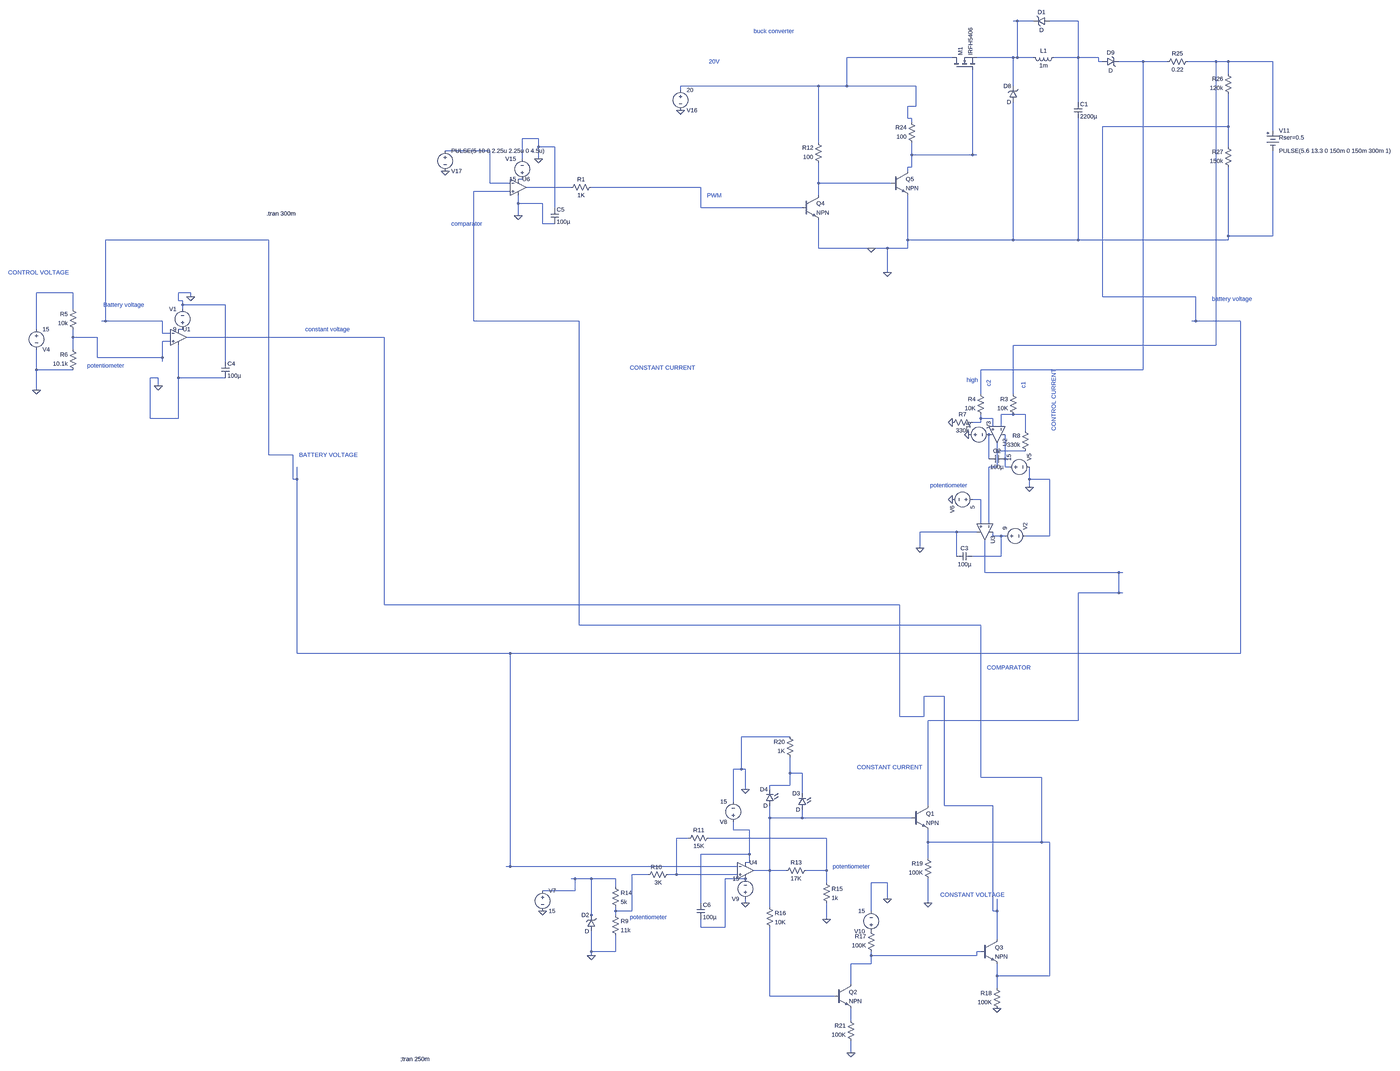
[diagram p0: schematic final_simulation_x.asc, whole sheet]
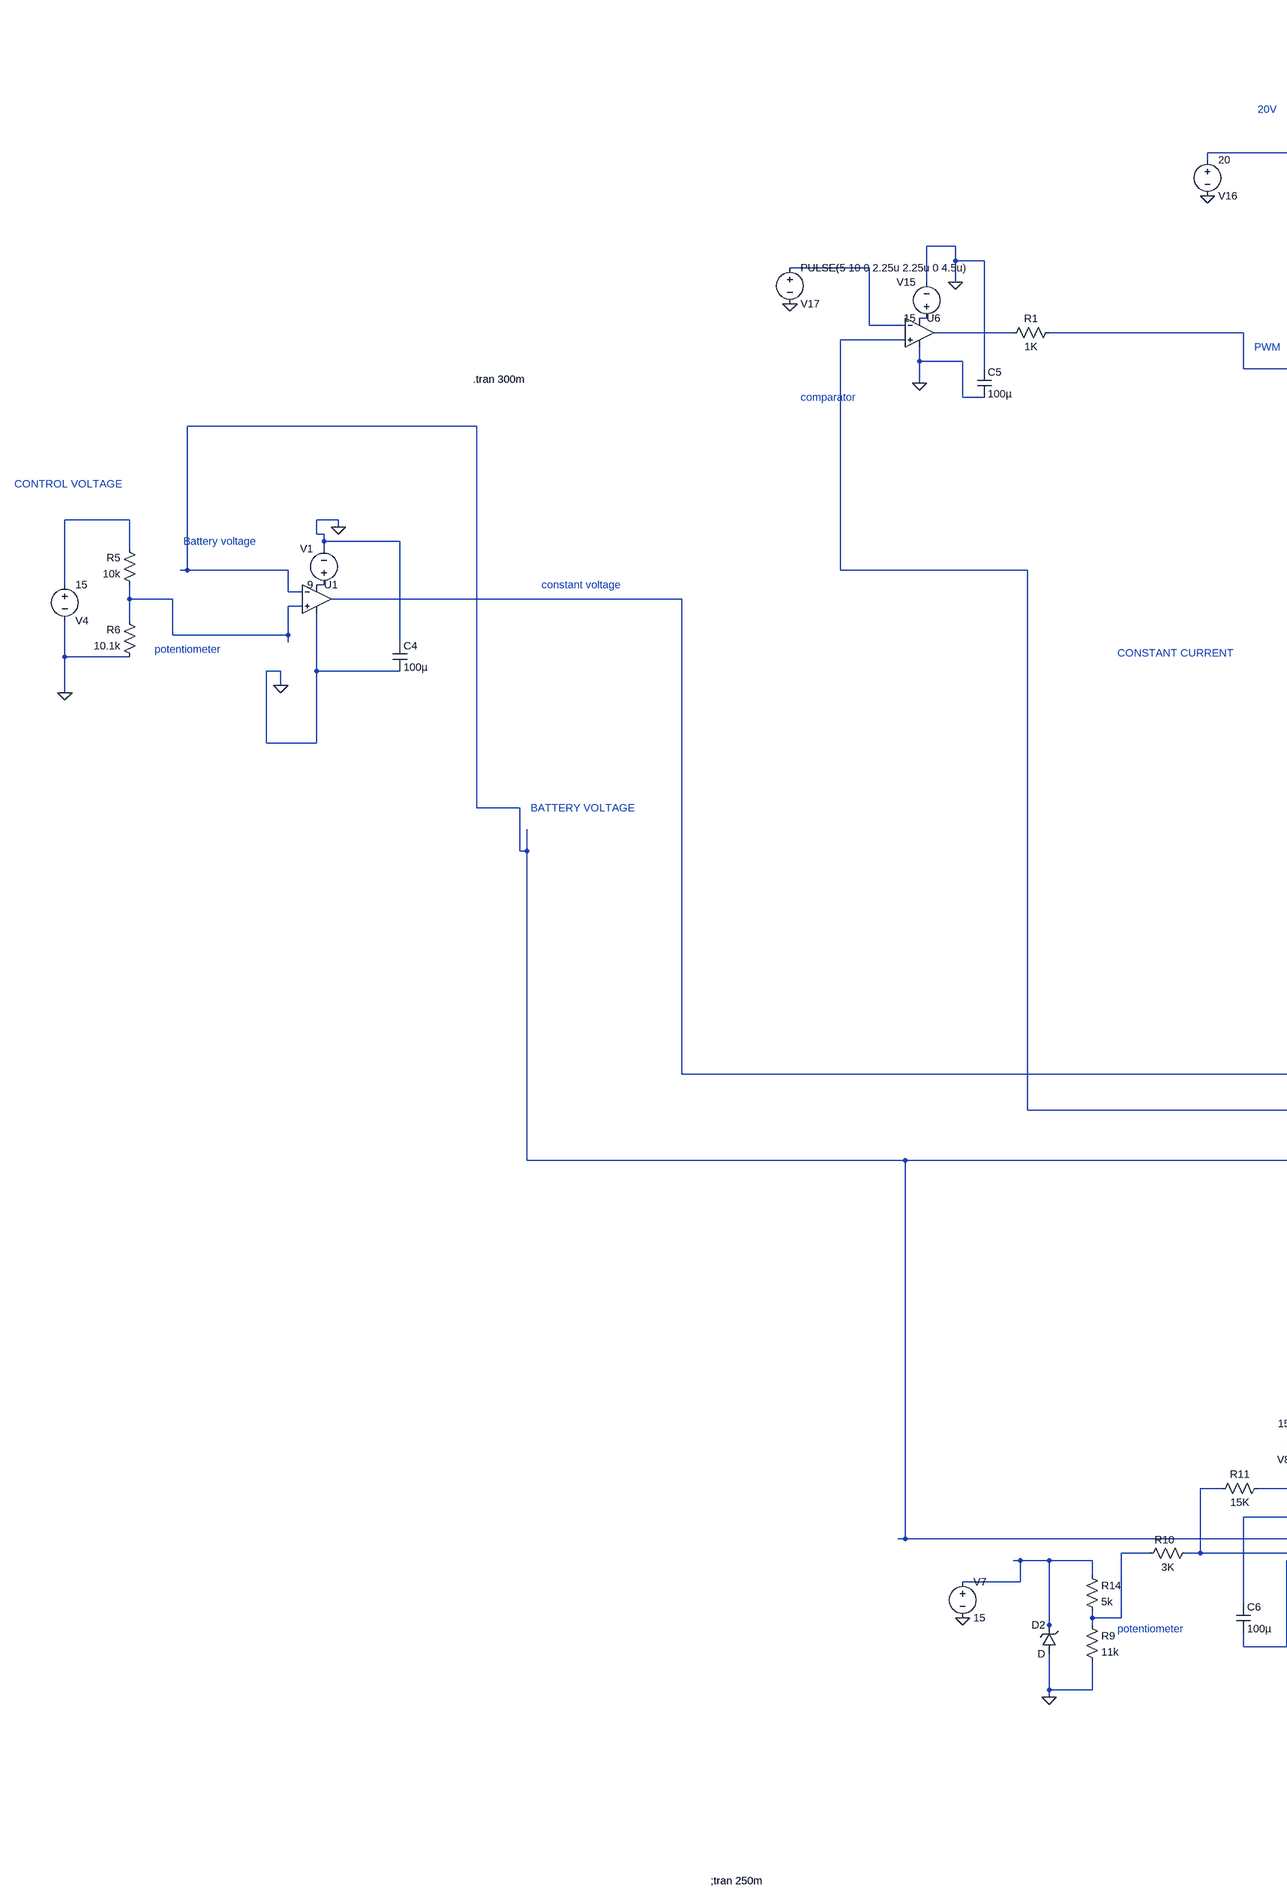
[diagram p1: schematic final_simulation_x.asc, part, row 1 of 1, column 1 of 2]
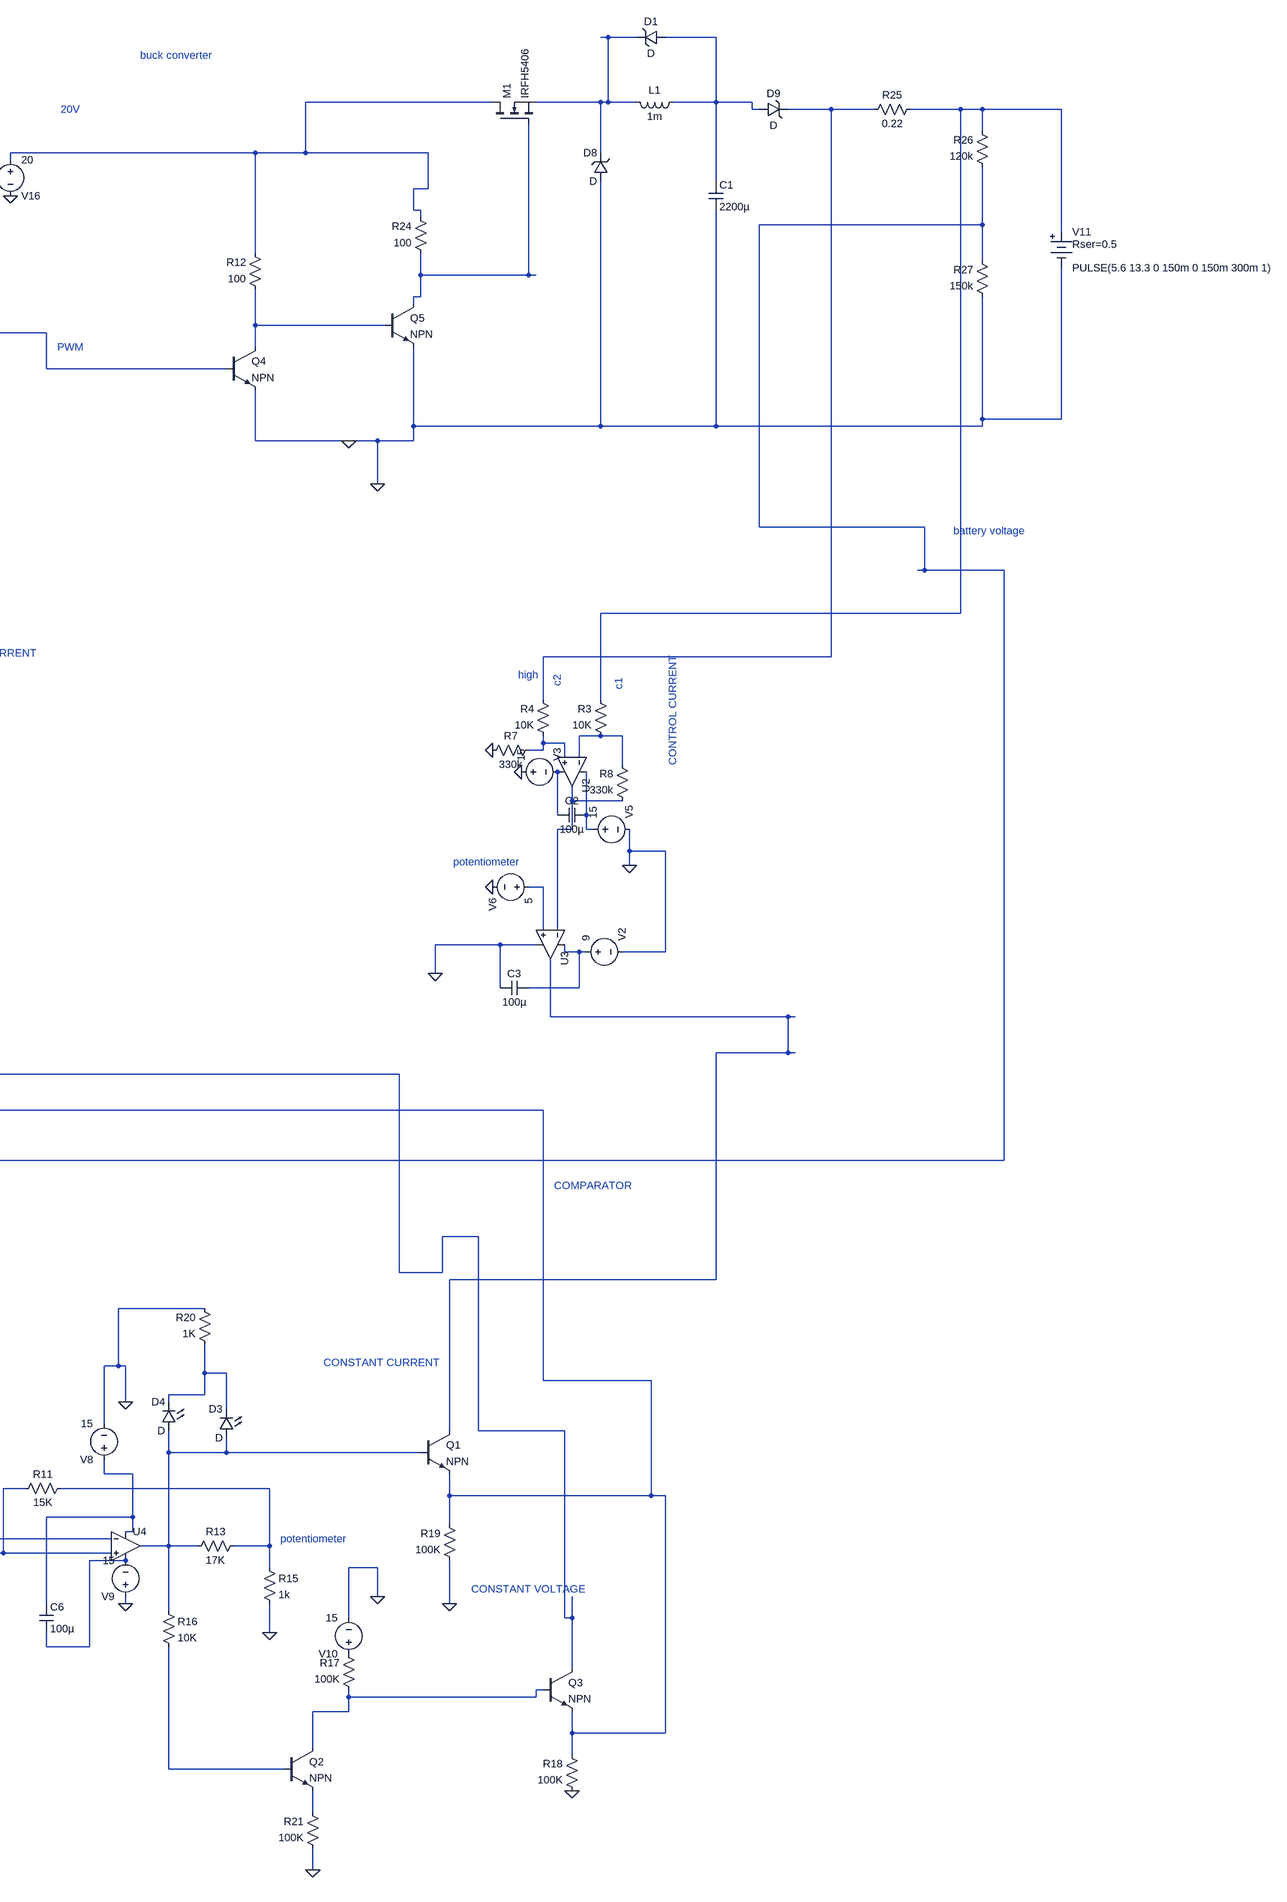
[diagram p2: schematic final_simulation_x.asc, part, row 1 of 1, column 2 of 2]
final_simulation_x.asc, the LTspice schematic file:
Version 4
SHEET 1 880 680
WIRE -407760 -284800 -407776 -284800
WIRE -407696 -284800 -407760 -284800
WIRE -407520 -284800 -407632 -284800
WIRE -408016 -284656 -408432 -284656
WIRE -407776 -284656 -407920 -284656
WIRE -407760 -284656 -407760 -284800
WIRE -407760 -284656 -407776 -284656
WIRE -407696 -284656 -407760 -284656
WIRE -407520 -284656 -407520 -284800
WIRE -407520 -284656 -407616 -284656
WIRE -407440 -284656 -407520 -284656
WIRE -407440 -284640 -407440 -284656
WIRE -407424 -284640 -407440 -284640
WIRE -407264 -284640 -407360 -284640
WIRE -407168 -284640 -407264 -284640
WIRE -406976 -284640 -407088 -284640
WIRE -406928 -284640 -406976 -284640
WIRE -406752 -284640 -406928 -284640
WIRE -406928 -284592 -406928 -284640
WIRE -408544 -284544 -409088 -284544
WIRE -408432 -284544 -408432 -284656
WIRE -408432 -284544 -408544 -284544
WIRE -408160 -284544 -408432 -284544
WIRE -407776 -284544 -407776 -284656
WIRE -409088 -284528 -409088 -284544
WIRE -407520 -284480 -407520 -284656
WIRE -408160 -284464 -408160 -284544
WIRE -408160 -284464 -408192 -284464
WIRE -408192 -284416 -408192 -284464
WIRE -408176 -284416 -408192 -284416
WIRE -408176 -284400 -408176 -284416
WIRE -406928 -284384 -406928 -284512
WIRE -406928 -284384 -407424 -284384
WIRE -406752 -284368 -406752 -284640
WIRE -409648 -284336 -409712 -284336
WIRE -408544 -284320 -408544 -284544
WIRE -409648 -284304 -409648 -284336
WIRE -409584 -284304 -409648 -284304
WIRE -406928 -284304 -406928 -284384
WIRE -409840 -284288 -410016 -284288
WIRE -408176 -284272 -408176 -284320
WIRE -407936 -284272 -407936 -284608
WIRE -407936 -284272 -408176 -284272
WIRE -407920 -284272 -407936 -284272
WIRE -409712 -284256 -409712 -284336
WIRE -409648 -284256 -409648 -284304
WIRE -408176 -284224 -408176 -284272
WIRE -408176 -284224 -408192 -284224
WIRE -408192 -284208 -408192 -284224
WIRE -409712 -284176 -409728 -284176
WIRE -409840 -284160 -409840 -284288
WIRE -409760 -284160 -409840 -284160
WIRE -408544 -284160 -408544 -284240
WIRE -408256 -284160 -408544 -284160
WIRE -409520 -284144 -409696 -284144
WIRE -409008 -284144 -409440 -284144
WIRE -409760 -284128 -409904 -284128
WIRE -408544 -284112 -408544 -284160
WIRE -409728 -284080 -409728 -284112
WIRE -409632 -284080 -409728 -284080
WIRE -409584 -284064 -409584 -284304
WIRE -409008 -284064 -409008 -284144
WIRE -408608 -284064 -409008 -284064
WIRE -409728 -284032 -409728 -284080
WIRE -409632 -284000 -409632 -284080
WIRE -409584 -284000 -409632 -284000
WIRE -406928 -283952 -406928 -284224
WIRE -406752 -283952 -406752 -284288
WIRE -406752 -283952 -406928 -283952
WIRE -410784 -283936 -411584 -283936
WIRE -408192 -283936 -408192 -284112
WIRE -407776 -283936 -407776 -284480
WIRE -407776 -283936 -408192 -283936
WIRE -407520 -283936 -407520 -284416
WIRE -407520 -283936 -407776 -283936
WIRE -406928 -283936 -406928 -283952
WIRE -406928 -283936 -407520 -283936
WIRE -408544 -283904 -408544 -284016
WIRE -408336 -283904 -408544 -283904
WIRE -408272 -283904 -408336 -283904
WIRE -408192 -283904 -408192 -283936
WIRE -408192 -283904 -408272 -283904
WIRE -408272 -283808 -408272 -283904
WIRE -411712 -283728 -411856 -283728
WIRE -411248 -283728 -411296 -283728
WIRE -411248 -283712 -411248 -283728
WIRE -407424 -283712 -407424 -284384
WIRE -407056 -283712 -407424 -283712
WIRE -411296 -283696 -411296 -283728
WIRE -411280 -283696 -411296 -283696
WIRE -411280 -283680 -411280 -283696
WIRE -411056 -283680 -411280 -283680
WIRE -411712 -283664 -411712 -283728
WIRE -411280 -283664 -411280 -283680
WIRE -411584 -283616 -411584 -283936
WIRE -411584 -283616 -411600 -283616
WIRE -411360 -283616 -411584 -283616
WIRE -409904 -283616 -409904 -284128
WIRE -409488 -283616 -409904 -283616
WIRE -407056 -283616 -407056 -283712
WIRE -407056 -283616 -407072 -283616
WIRE -406880 -283616 -407056 -283616
WIRE -411856 -283584 -411856 -283728
WIRE -411280 -283584 -411296 -283584
WIRE -411360 -283568 -411360 -283616
WIRE -411328 -283568 -411360 -283568
WIRE -411712 -283552 -411712 -283584
WIRE -411616 -283552 -411712 -283552
WIRE -410256 -283552 -411264 -283552
WIRE -411328 -283536 -411360 -283536
WIRE -406976 -283520 -406976 -284640
WIRE -406976 -283520 -407776 -283520
WIRE -411712 -283504 -411712 -283552
WIRE -411616 -283472 -411616 -283552
WIRE -411360 -283472 -411360 -283536
WIRE -411360 -283472 -411616 -283472
WIRE -411360 -283456 -411360 -283472
WIRE -411056 -283456 -411056 -283680
WIRE -411856 -283424 -411856 -283504
WIRE -411712 -283424 -411856 -283424
WIRE -407264 -283424 -407264 -284640
WIRE -407264 -283424 -407904 -283424
WIRE -411376 -283392 -411408 -283392
WIRE -411296 -283392 -411296 -283520
WIRE -411056 -283392 -411296 -283392
WIRE -411376 -283360 -411376 -283392
WIRE -411856 -283344 -411856 -283424
WIRE -407904 -283328 -407904 -283424
WIRE -407776 -283328 -407776 -283520
WIRE -407776 -283248 -407824 -283248
WIRE -407728 -283248 -407776 -283248
WIRE -411408 -283232 -411408 -283392
WIRE -411296 -283232 -411296 -283392
WIRE -411296 -283232 -411408 -283232
WIRE -407904 -283232 -407904 -283248
WIRE -407856 -283232 -407904 -283232
WIRE -407904 -283216 -407904 -283232
WIRE -407904 -283216 -407936 -283216
WIRE -407856 -283200 -407856 -283232
WIRE -407824 -283200 -407824 -283248
WIRE -407728 -283184 -407728 -283248
WIRE -407840 -283104 -407840 -283136
WIRE -407728 -283104 -407840 -283104
WIRE -410784 -283088 -410784 -283936
WIRE -410688 -283088 -410784 -283088
WIRE -407872 -283072 -407872 -283168
WIRE -407808 -283072 -407808 -283168
WIRE -407840 -283040 -407840 -283104
WIRE -407840 -283040 -407872 -283040
WIRE -407808 -283040 -407808 -283072
WIRE -407792 -283040 -407808 -283040
WIRE -410688 -282992 -410688 -283088
WIRE -410672 -282992 -410672 -283040
WIRE -410672 -282992 -410688 -282992
WIRE -407712 -282992 -407712 -283040
WIRE -407632 -282992 -407712 -282992
WIRE -407712 -282960 -407712 -282992
WIRE -407904 -282912 -407936 -282912
WIRE -407904 -282816 -407904 -282912
WIRE -407872 -282816 -407872 -283040
WIRE -408000 -282784 -408144 -282784
WIRE -407920 -282784 -408000 -282784
WIRE -407856 -282768 -407856 -282784
WIRE -407824 -282768 -407856 -282768
WIRE -407808 -282768 -407824 -282768
WIRE -407632 -282768 -407632 -282992
WIRE -407632 -282768 -407728 -282768
WIRE -408144 -282720 -408144 -282784
WIRE -408000 -282688 -408000 -282784
WIRE -407824 -282688 -407824 -282768
WIRE -407824 -282688 -407936 -282688
WIRE -407888 -282624 -407888 -282752
WIRE -407360 -282624 -407888 -282624
WIRE -407344 -282624 -407360 -282624
WIRE -407360 -282544 -407360 -282624
WIRE -407360 -282544 -407520 -282544
WIRE -407344 -282544 -407360 -282544
WIRE -410256 -282496 -410256 -283552
WIRE -408224 -282496 -410256 -282496
WIRE -409488 -282416 -409488 -283616
WIRE -407904 -282416 -409488 -282416
WIRE -410672 -282128 -410672 -282992
WIRE -409760 -282128 -410672 -282128
WIRE -406880 -282128 -406880 -283616
WIRE -406880 -282128 -409760 -282128
WIRE -408048 -281904 -408128 -281904
WIRE -408224 -281824 -408224 -282496
WIRE -408128 -281824 -408128 -281904
WIRE -408128 -281824 -408224 -281824
WIRE -407520 -281808 -407520 -282544
WIRE -407520 -281808 -408112 -281808
WIRE -408656 -281744 -408848 -281744
WIRE -408848 -281616 -408848 -281744
WIRE -408848 -281616 -408880 -281616
WIRE -408832 -281616 -408848 -281616
WIRE -408656 -281600 -408656 -281664
WIRE -408608 -281600 -408656 -281600
WIRE -407904 -281584 -407904 -282416
WIRE -407664 -281584 -407904 -281584
WIRE -408656 -281552 -408656 -281600
WIRE -408656 -281552 -408736 -281552
WIRE -408832 -281536 -408832 -281616
WIRE -408736 -281536 -408736 -281552
WIRE -408608 -281520 -408608 -281600
WIRE -408880 -281488 -408880 -281616
WIRE -408112 -281472 -408112 -281808
WIRE -408048 -281472 -408048 -281904
WIRE -407856 -281472 -408048 -281472
WIRE -408736 -281424 -408736 -281472
WIRE -408608 -281424 -408608 -281456
WIRE -408608 -281424 -408736 -281424
WIRE -408176 -281424 -408608 -281424
WIRE -408880 -281376 -408880 -281408
WIRE -408816 -281376 -408880 -281376
WIRE -409056 -281344 -409104 -281344
WIRE -408512 -281344 -408976 -281344
WIRE -408112 -281328 -408112 -281376
WIRE -407664 -281328 -407664 -281584
WIRE -407664 -281328 -408112 -281328
WIRE -407632 -281328 -407664 -281328
WIRE -408816 -281280 -408816 -281376
WIRE -408816 -281280 -409008 -281280
WIRE -408112 -281264 -408112 -281328
WIRE -408816 -281248 -408816 -281280
WIRE -408816 -281248 -408832 -281248
WIRE -409760 -281232 -409760 -282128
WIRE -409760 -281232 -409776 -281232
WIRE -408864 -281232 -409760 -281232
WIRE -408736 -281216 -408736 -281424
WIRE -408736 -281216 -408800 -281216
WIRE -408672 -281216 -408736 -281216
WIRE -408512 -281216 -408512 -281344
WIRE -408512 -281216 -408592 -281216
WIRE -409216 -281200 -409280 -281200
WIRE -409104 -281200 -409104 -281344
WIRE -409104 -281200 -409136 -281200
WIRE -408864 -281200 -409104 -281200
WIRE -409504 -281184 -409520 -281184
WIRE -409440 -281184 -409504 -281184
WIRE -409344 -281184 -409440 -281184
WIRE -408832 -281184 -408912 -281184
WIRE -408512 -281168 -408512 -281216
WIRE -408272 -281168 -408336 -281168
WIRE -409344 -281152 -409344 -281184
WIRE -409504 -281136 -409504 -281184
WIRE -409504 -281136 -409632 -281136
WIRE -408272 -281104 -408272 -281168
WIRE -409008 -281088 -409008 -281280
WIRE -408832 -281088 -408832 -281104
WIRE -408112 -281088 -408112 -281184
WIRE -408736 -281072 -408736 -281216
WIRE -409344 -281056 -409344 -281072
WIRE -409280 -281056 -409280 -281200
WIRE -409280 -281056 -409344 -281056
WIRE -408336 -281056 -408336 -281168
WIRE -407856 -281056 -407856 -281472
WIRE -407840 -281056 -407840 -281104
WIRE -407840 -281056 -407856 -281056
WIRE -409440 -281040 -409440 -281184
WIRE -409344 -281040 -409344 -281056
WIRE -409440 -281024 -409440 -281040
WIRE -408512 -281024 -408512 -281088
WIRE -409008 -280992 -409008 -281024
WIRE -408912 -280992 -408912 -281184
WIRE -408912 -280992 -409008 -280992
WIRE -407840 -280944 -407840 -281056
WIRE -409440 -280896 -409440 -280976
WIRE -409344 -280896 -409344 -280960
WIRE -409344 -280896 -409440 -280896
WIRE -407904 -280896 -407920 -280896
WIRE -409440 -280880 -409440 -280896
WIRE -408336 -280880 -408336 -280896
WIRE -407920 -280880 -407920 -280896
WIRE -407920 -280880 -408336 -280880
WIRE -408336 -280848 -408336 -280880
WIRE -408336 -280848 -408416 -280848
WIRE -407840 -280800 -407840 -280848
WIRE -407632 -280800 -407632 -281328
WIRE -407632 -280800 -407840 -280800
WIRE -408416 -280768 -408416 -280848
WIRE -407840 -280752 -407840 -280800
WIRE -408736 -280720 -408736 -280992
WIRE -408480 -280720 -408736 -280720
WIRE -408416 -280624 -408416 -280672
WIRE -408416 -280496 -408416 -280544
FLAG -411248 -283712 0
FLAG -411376 -283360 0
FLAG -411856 -283344 0
FLAG -408016 -283216 0
FLAG -407712 -282960 0
FLAG -407952 -283168 0
FLAG -408016 -282912 0
FLAG -408336 -283904 0
FLAG -408272 -283808 0
FLAG -409648 -284256 0
FLAG -409728 -284032 0
FLAG -410016 -284208 0
FLAG -409088 -284448 0
FLAG -409440 -280880 0
FLAG -408512 -281024 0
FLAG -409632 -281056 0
FLAG -408832 -281536 0
FLAG -408832 -281088 0
FLAG -408272 -281104 0
FLAG -407840 -280672 0
FLAG -408112 -281088 0
FLAG -408416 -280496 0
FLAG -408144 -282720 0
DATAFLAG -408016 -281472 ""
DATAFLAG -409680 -284144 ""
DATAFLAG -407456 -283936 ""
SYMBOL voltage -411280 -283568 R180
WINDOW 0 24 96 Left 2
WINDOW 3 24 16 Left 2
WINDOW 123 0 0 Left 0
WINDOW 39 0 0 Left 0
SYMATTR InstName V1
SYMATTR Value 9
SYMBOL res -411696 -283568 R180
WINDOW 0 36 76 Left 2
WINDOW 3 36 40 Left 2
SYMATTR InstName R5
SYMATTR Value 10k
SYMBOL res -411696 -283408 R180
WINDOW 0 36 76 Left 2
WINDOW 3 36 40 Left 2
SYMATTR InstName R6
SYMATTR Value 10.1k
SYMBOL voltage -411856 -283600 R0
WINDOW 0 24 96 Left 2
WINDOW 3 24 16 Left 2
WINDOW 123 0 0 Left 0
WINDOW 39 0 0 Left 0
SYMATTR InstName V4
SYMATTR Value 15
SYMBOL res -407760 -283232 R180
WINDOW 0 36 76 Left 2
WINDOW 3 36 40 Left 2
SYMATTR InstName R3
SYMATTR Value 10K
SYMBOL res -407888 -283232 R180
WINDOW 0 36 76 Left 2
WINDOW 3 36 40 Left 2
SYMATTR InstName R4
SYMATTR Value 10K
SYMBOL res -408032 -283200 R270
WINDOW 0 32 56 VTop 2
WINDOW 3 0 56 VBottom 2
SYMATTR InstName R7
SYMATTR Value 330k
SYMBOL res -407712 -283088 R180
WINDOW 0 36 76 Left 2
WINDOW 3 36 40 Left 2
SYMATTR InstName R8
SYMATTR Value 330k
SYMBOL voltage -407968 -283168 R270
WINDOW 0 24 96 Left 2
WINDOW 3 24 16 Left 2
WINDOW 123 0 0 Left 0
WINDOW 39 0 0 Left 0
SYMATTR InstName V3
SYMATTR Value 15
SYMBOL voltage -407808 -283040 R270
WINDOW 0 24 96 Left 2
WINDOW 3 24 16 Left 2
WINDOW 123 0 0 Left 0
WINDOW 39 0 0 Left 0
SYMATTR InstName V5
SYMATTR Value 15
SYMBOL voltage -407920 -282912 R90
WINDOW 0 24 96 Left 2
WINDOW 3 24 16 Left 2
WINDOW 123 0 0 Left 0
WINDOW 39 0 0 Left 0
SYMATTR InstName V6
SYMATTR Value 5
SYMBOL res -408528 -284224 R180
WINDOW 0 36 76 Left 2
WINDOW 3 36 40 Left 2
SYMATTR InstName R12
SYMATTR Value 100
SYMBOL res -408160 -284304 R180
WINDOW 0 36 76 Left 2
WINDOW 3 36 40 Left 2
SYMATTR InstName R24
SYMATTR Value 100
SYMBOL npn -408608 -284112 R0
SYMATTR InstName Q4
SYMBOL npn -408256 -284208 R0
SYMATTR InstName Q5
SYMBOL nmos -408016 -284608 R270
SYMATTR InstName M1
SYMATTR Value IRFH5406
SYMBOL zener -407760 -284480 R180
WINDOW 0 24 64 Left 2
WINDOW 3 24 0 Left 2
SYMATTR InstName D8
SYMBOL ind -407600 -284672 R90
WINDOW 0 5 56 VBottom 2
WINDOW 3 32 56 VTop 2
SYMATTR InstName L1
SYMATTR Value 1m
SYMBOL cap -407536 -284480 R0
SYMATTR InstName C1
SYMATTR Value 2200µ
SYMATTR SpiceLine2 ic=0
SYMBOL zener -407424 -284624 R270
WINDOW 0 36 32 VTop 2
WINDOW 3 -4 32 VBottom 2
SYMATTR InstName D9
SYMBOL res -407072 -284656 R90
WINDOW 0 0 56 VBottom 2
WINDOW 3 32 56 VTop 2
SYMATTR InstName R25
SYMATTR Value 0.22
SYMBOL res -406912 -284496 R180
WINDOW 0 36 76 Left 2
WINDOW 3 36 40 Left 2
SYMATTR InstName R26
SYMATTR Value 120k
SYMBOL res -406912 -284208 R180
WINDOW 0 36 76 Left 2
WINDOW 3 36 40 Left 2
SYMATTR InstName R27
SYMATTR Value 150k
SYMBOL Misc\\battery -406752 -284384 R0
WINDOW 123 0 0 Left 0
WINDOW 39 24 44 Left 2
SYMATTR SpiceLine Rser=0.5
SYMATTR InstName V11
SYMATTR Value PULSE(5.6 13.3 0 150m 0 150m 300m 1)
SYMBOL voltage -409712 -284160 R180
WINDOW 0 24 96 Left 2
WINDOW 3 24 16 Left 2
WINDOW 123 0 0 Left 0
WINDOW 39 0 0 Left 0
SYMATTR InstName V15
SYMATTR Value 15
SYMBOL voltage -409088 -284544 R0
WINDOW 0 24 96 Left 2
WINDOW 3 24 16 Left 2
WINDOW 123 0 0 Left 0
WINDOW 39 0 0 Left 0
SYMATTR InstName V16
SYMATTR Value 20
SYMBOL voltage -410016 -284304 R0
WINDOW 0 24 96 Left 2
WINDOW 3 24 16 Left 2
WINDOW 123 0 0 Left 0
WINDOW 39 0 0 Left 0
SYMATTR InstName V17
SYMATTR Value PULSE(5 10 0 2.25u 2.25u 0 4.5u)
SYMBOL OpAmps\\UniversalOpAmp2 -411296 -283552 R0
SYMATTR InstName U1
SYMBOL OpAmps\\UniversalOpAmp2 -409728 -284144 R0
SYMATTR InstName U6
SYMBOL OpAmps\\UniversalOpAmp2 -407840 -283168 R90
SYMATTR InstName U2
SYMBOL OpAmps\\UniversalOpAmp2 -407888 -282784 R90
SYMATTR InstName U3
SYMBOL zener -407632 -284816 R90
WINDOW 0 -4 32 VBottom 2
WINDOW 3 36 32 VTop 2
SYMATTR InstName D1
SYMBOL zener -409424 -280976 R180
WINDOW 0 24 64 Left 2
WINDOW 3 24 0 Left 2
SYMATTR InstName D2
SYMBOL res -409360 -281056 R0
SYMATTR InstName R9
SYMATTR Value 11k
SYMBOL res -409120 -281216 R90
WINDOW 0 2 63 VBottom 2
WINDOW 3 32 56 VTop 2
SYMATTR InstName R10
SYMATTR Value 3K
SYMBOL res -408960 -281360 R90
WINDOW 0 0 56 VBottom 2
WINDOW 3 32 56 VTop 2
SYMATTR InstName R11
SYMATTR Value 15K
SYMBOL LED -408592 -281456 R180
WINDOW 0 24 64 Left 2
WINDOW 3 24 0 Left 2
SYMATTR InstName D3
SYMBOL res -408576 -281232 R90
WINDOW 0 0 56 VBottom 2
WINDOW 3 32 56 VTop 2
SYMATTR InstName R13
SYMATTR Value 17K
SYMBOL res -409360 -281168 R0
SYMATTR InstName R14
SYMATTR Value 5k
SYMBOL LED -408720 -281472 R180
WINDOW 0 24 64 Left 2
WINDOW 3 24 0 Left 2
SYMATTR InstName D4
SYMBOL res -408528 -281184 R0
SYMATTR InstName R15
SYMATTR Value 1k
SYMBOL res -408752 -281088 R0
SYMATTR InstName R16
SYMATTR Value 10K
SYMBOL voltage -409632 -281152 R0
WINDOW 123 0 0 Left 0
WINDOW 39 0 0 Left 0
SYMATTR InstName V7
SYMATTR Value 15
SYMBOL voltage -408880 -281392 R180
WINDOW 123 0 0 Left 0
WINDOW 39 0 0 Left 0
SYMATTR InstName V8
SYMATTR Value 15
SYMBOL voltage -408832 -281088 R180
WINDOW 123 0 0 Left 0
WINDOW 39 0 0 Left 0
SYMATTR InstName V9
SYMATTR Value 15
SYMBOL npn -408176 -281472 R0
SYMATTR InstName Q1
SYMBOL npn -408480 -280768 R0
SYMATTR InstName Q2
SYMBOL npn -407904 -280944 R0
SYMATTR InstName Q3
SYMBOL res -408320 -280880 R180
WINDOW 0 36 76 Left 2
WINDOW 3 36 40 Left 2
SYMATTR InstName R17
SYMATTR Value 100K
SYMBOL res -407824 -280656 R180
WINDOW 0 36 76 Left 2
WINDOW 3 36 40 Left 2
SYMATTR InstName R18
SYMATTR Value 100K
SYMBOL res -408096 -281168 R180
WINDOW 0 36 76 Left 2
WINDOW 3 36 40 Left 2
SYMATTR InstName R19
SYMATTR Value 100K
SYMBOL res -408640 -281648 R180
WINDOW 0 36 76 Left 2
WINDOW 3 36 40 Left 2
SYMATTR InstName R20
SYMATTR Value 1K
SYMBOL voltage -408336 -280960 R180
WINDOW 123 0 0 Left 0
WINDOW 39 0 0 Left 0
SYMATTR InstName V10
SYMATTR Value 15
SYMBOL res -408400 -280528 R180
WINDOW 0 36 76 Left 2
WINDOW 3 36 40 Left 2
SYMATTR InstName R21
SYMATTR Value 100K
SYMBOL OpAmps\\UniversalOpAmp2 -408832 -281216 R0
SYMATTR InstName U4
SYMBOL voltage -407824 -282768 R270
WINDOW 0 24 96 Left 2
WINDOW 3 24 16 Left 2
WINDOW 123 0 0 Left 0
WINDOW 39 0 0 Left 0
SYMATTR InstName V2
SYMATTR Value 9
SYMBOL res -409424 -284160 R90
WINDOW 0 0 56 VBottom 2
WINDOW 3 32 56 VTop 2
SYMATTR InstName R1
SYMATTR Value 1K
SYMBOL cap -407872 -283056 R270
WINDOW 0 32 32 VTop 2
WINDOW 3 0 32 VBottom 2
SYMATTR InstName C2
SYMATTR Value 100µ
SYMBOL cap -407936 -282704 R90
WINDOW 0 0 32 VBottom 2
WINDOW 3 32 32 VTop 2
SYMATTR InstName C3
SYMATTR Value 100µ
SYMBOL cap -411072 -283456 R0
SYMATTR InstName C4
SYMATTR Value 100µ
SYMBOL cap -409600 -284064 R0
SYMATTR InstName C5
SYMATTR Value 100µ
SYMBOL cap -409024 -281088 R0
SYMATTR InstName C6
SYMATTR Value 100µ
TEXT -411968 -283808 Left 2 ;CONTROL VOLTAGE
TEXT -407616 -283424 VRight 2 ;CONTROL CURRENT
TEXT -411592 -283680 Left 2 ;Battery voltage
TEXT -407736 -283376 VRight 2 ;c1
TEXT -407872 -283384 VRight 2 ;c2
TEXT -410664 -283088 Left 2 ;BATTERY VOLTAGE
TEXT -409288 -283432 Left 2 ;CONSTANT CURRENT
TEXT -408976 -284640 Left 2 ;20V
TEXT -408984 -284112 Left 2 ;PWM
TEXT -406992 -283704 Left 2 ;battery voltage
TEXT -408800 -284760 Left 2 ;buck converter
TEXT -410792 -284040 Left 2 !.tran 300m
TEXT -409992 -284000 Left 2 ;comparator
TEXT -407960 -283384 Left 2 ;high
TEXT -410640 -283584 Left 2 ;constant voltage
TEXT -408392 -281624 Left 2 ;CONSTANT CURRENT
TEXT -408064 -281120 Left 2 ;CONSTANT VOLTAGE
TEXT -407880 -282072 Left 2 ;COMPARATOR
TEXT -410192 -280472 Left 2 !;tran 250m
TEXT -408104 -282968 Left 2 ;potentiometer
TEXT -411656 -283440 Left 2 ;potentiometer
TEXT -409288 -281032 Left 2 ;potentiometer
TEXT -408488 -281232 Left 2 ;potentiometer

The netlist it stands for:
* final_simulation_x.asc
V1 N015 0 9
R5 N016 N014 10k
R6 0 N016 10.1k
V4 N014 0 15
R3 N018 N005 10K
R4 N019 N004 10K
R7 0 N019 330k
R8 N020 N018 330k
V3 0 N021 15
V5 N022 0 15
V6 N023 0 5
R12 N010 N003 100
R24 N008 N003 100
Q4 N010 N012 0 0 NPN
Q5 N008 N010 0 0 NPN
M1 N003 N008 N001 N001 IRFH5406
D8 0 N001 D
L1 N002 N001 1m
C1 N002 0 2200µ ic=0
D9 N002 N004 D
R25 N005 N004 0.22
R26 N006 N005 120k
R27 0 N006 150k
V11 N005 0 PULSE(5.6 13.3 0 150m 0 150m 300m 1) Rser=0.5
V15 N009 0 15
V16 N003 0 20
V17 N007 0 PULSE(5 10 0 2.25u 2.25u 0 4.5u)
XU1 N016 N006 N015 0 N017 level2 Avol=1Meg GBW=10Meg Slew=10Meg Ilimit=25m Rail=0 Vos=0 En=0 Enk=0 In=0 Ink=0 Rin=500Meg  ; pins In+ In- V+ V- OUT
XU6 N013 N007 N009 0 N011 level2 Avol=1Meg GBW=10Meg Slew=10Meg Ilimit=25m Rail=0 Vos=0 En=0 Enk=0 In=0 Ink=0 Rin=500Meg  ; pins In+ In- V+ V- OUT
XU2 N019 N018 N022 N021 N020 level2 Avol=1Meg GBW=10Meg Slew=10Meg Ilimit=25m Rail=0 Vos=0 En=0 Enk=0 In=0 Ink=0 Rin=500Meg  ; pins In+ In- V+ V- OUT
XU3 N023 N020 N024 0 N025 level2 Avol=1Meg GBW=10Meg Slew=10Meg Ilimit=25m Rail=0 Vos=0 En=0 Enk=0 In=0 Ink=0 Rin=500Meg  ; pins In+ In- V+ V- OUT
D1 N002 N001 D
D2 0 N032 D
R9 N031 0 11k
R10 N029 N031 3K
R11 N030 N029 15K
D3 N027 N026 D
R13 N030 N027 17K
R14 N032 N031 5k
D4 N027 N026 D
R15 N030 0 1k
R16 N027 N035 10K
V7 N032 0 15
V8 N028 0 15
V9 0 N033 15
Q1 N025 N027 N013 0 NPN
Q2 N034 N035 N036 0 NPN
Q3 N017 N034 N013 0 NPN
R17 N034 P001 100K
R18 0 N013 100K
R19 0 N013 100K
R20 N026 0 1K
V10 P001 0 15
R21 0 N036 100K
XU4 N029 N006 N028 N033 N027 level2 Avol=1Meg GBW=10Meg Slew=10Meg Ilimit=25m Rail=0 Vos=0 En=0 Enk=0 In=0 Ink=0 Rin=500Meg  ; pins In+ In- V+ V- OUT
V2 N024 0 9
R1 N012 N011 1K
C2 N021 N022 100µ
C3 N024 0 100µ
C4 0 0 100µ
C5 0 0 100µ
C6 N028 N033 100µ
.model D D
.lib standard.dio
.model NPN NPN
.model PNP PNP
.lib standard.bjt
.model NMOS NMOS
.model PMOS PMOS
.lib standard.mos
* CONTROL VOLTAGE
* CONTROL CURRENT
* Battery voltage
* c1
* c2
* BATTERY VOLTAGE
* CONSTANT CURRENT
* 20V
* PWM
* battery voltage
* buck converter
.tran 300m
* comparator
* high
* constant voltage
* CONSTANT CURRENT
* CONSTANT VOLTAGE
* COMPARATOR
;tran 250m
* potentiometer
* potentiometer
* potentiometer
* potentiometer
.lib UniversalOpAmp2.lib
.backanno
.end